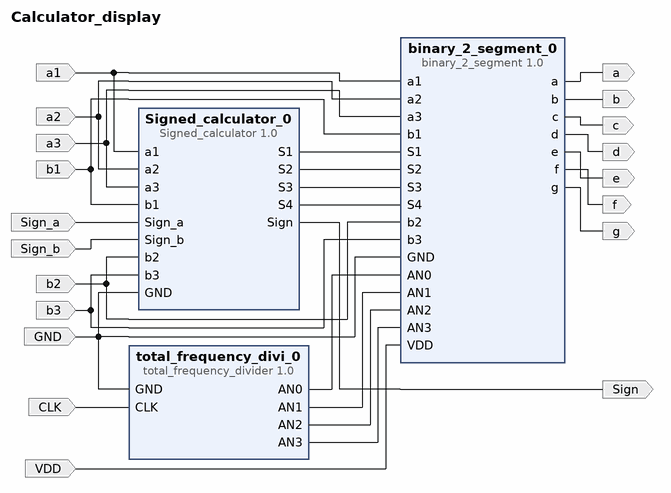
[diagram p0: block diagram of the top level]
# Vivado block design Calculator_display, xc7a35tcpg236-1, Vivado 2021.1
create_bd_design Calculator_display

create_bd_port -dir I GND
create_bd_port -dir I Sign_a
create_bd_port -dir I Sign_b
create_bd_port -dir I a1
create_bd_port -dir I a2
create_bd_port -dir I a3
create_bd_port -dir I b1
create_bd_port -dir I b2
create_bd_port -dir I b3
create_bd_port -dir O Sign
create_bd_port -dir I CLK
create_bd_port -dir O a
create_bd_port -dir O b
create_bd_port -dir O c
create_bd_port -dir O d
create_bd_port -dir O e
create_bd_port -dir O f
create_bd_port -dir O g
create_bd_port -dir I VDD

create_bd_cell -type ip -vlnv xilinx.com:user:Signed_calculator:1.0 Signed_calculator_0
create_bd_cell -type ip -vlnv xilinx.com:user:binary_2_segment:1.0 binary_2_segment_0
create_bd_cell -type ip -vlnv xilinx.com:user:total_frequency_divider:1.0 total_frequency_divi_0

# ---- connections ----

connect_bd_net [get_bd_ports CLK] [get_bd_pins total_frequency_divi_0/CLK]
connect_bd_net [get_bd_ports GND] [get_bd_pins Signed_calculator_0/GND] [get_bd_pins binary_2_segment_0/GND] [get_bd_pins total_frequency_divi_0/GND]
connect_bd_net [get_bd_ports Sign_a] [get_bd_pins Signed_calculator_0/Sign_a]
connect_bd_net [get_bd_ports Sign_b] [get_bd_pins Signed_calculator_0/Sign_b]
connect_bd_net [get_bd_pins Signed_calculator_0/S1] [get_bd_pins binary_2_segment_0/S1]
connect_bd_net [get_bd_pins Signed_calculator_0/S2] [get_bd_pins binary_2_segment_0/S2]
connect_bd_net [get_bd_pins Signed_calculator_0/S3] [get_bd_pins binary_2_segment_0/S3]
connect_bd_net [get_bd_pins Signed_calculator_0/S4] [get_bd_pins binary_2_segment_0/S4]
connect_bd_net [get_bd_pins Signed_calculator_0/Sign] [get_bd_ports Sign]
connect_bd_net [get_bd_ports VDD] [get_bd_pins binary_2_segment_0/VDD]
connect_bd_net -net a1_1 [get_bd_ports a1] [get_bd_pins Signed_calculator_0/a1] [get_bd_pins binary_2_segment_0/a1]
connect_bd_net -net a2_1 [get_bd_ports a2] [get_bd_pins Signed_calculator_0/a2] [get_bd_pins binary_2_segment_0/a2]
connect_bd_net -net a3_1 [get_bd_ports a3] [get_bd_pins Signed_calculator_0/a3] [get_bd_pins binary_2_segment_0/a3]
connect_bd_net -net b1_1 [get_bd_ports b1] [get_bd_pins Signed_calculator_0/b1] [get_bd_pins binary_2_segment_0/b1]
connect_bd_net -net b2_1 [get_bd_ports b2] [get_bd_pins Signed_calculator_0/b2] [get_bd_pins binary_2_segment_0/b2]
connect_bd_net -net b3_1 [get_bd_ports b3] [get_bd_pins Signed_calculator_0/b3] [get_bd_pins binary_2_segment_0/b3]
connect_bd_net [get_bd_pins binary_2_segment_0/a] [get_bd_ports a]
connect_bd_net [get_bd_pins binary_2_segment_0/b] [get_bd_ports b]
connect_bd_net [get_bd_pins binary_2_segment_0/c] [get_bd_ports c]
connect_bd_net [get_bd_pins binary_2_segment_0/d] [get_bd_ports d]
connect_bd_net [get_bd_pins binary_2_segment_0/e] [get_bd_ports e]
connect_bd_net [get_bd_pins binary_2_segment_0/f] [get_bd_ports f]
connect_bd_net [get_bd_pins binary_2_segment_0/g] [get_bd_ports g]
connect_bd_net [get_bd_pins total_frequency_divi_0/AN0] [get_bd_pins binary_2_segment_0/AN0]
connect_bd_net [get_bd_pins total_frequency_divi_0/AN1] [get_bd_pins binary_2_segment_0/AN1]
connect_bd_net [get_bd_pins total_frequency_divi_0/AN2] [get_bd_pins binary_2_segment_0/AN2]
connect_bd_net [get_bd_pins total_frequency_divi_0/AN3] [get_bd_pins binary_2_segment_0/AN3]

validate_bd_design
save_bd_design
